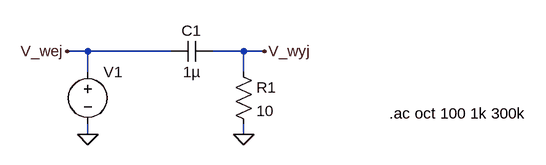
[diagram p0: schematic Draft4.asc]
Draft4.asc, the LTspice schematic file:
Version 4
SHEET 1 880 680
WIRE 16 144 -16 144
WIRE 144 144 16 144
WIRE 256 144 208 144
WIRE 288 144 256 144
WIRE 16 176 16 144
WIRE 256 176 256 144
WIRE 16 272 16 256
WIRE 256 272 256 256
FLAG 16 272 0
FLAG 256 272 0
FLAG -16 144 V_wej
FLAG 288 144 V_wyj
SYMBOL res 240 160 R0
SYMATTR InstName R1
SYMATTR Value 10
SYMATTR SpiceLine tol=1 pwr=0.1
SYMBOL voltage 16 160 R0
WINDOW 3 24 96 Invisible 2
WINDOW 39 0 0 Left 0
SYMATTR InstName V1
SYMATTR Value 5
SYMATTR Value2 AC 1
SYMBOL cap 208 128 R90
WINDOW 0 0 32 VBottom 2
WINDOW 3 32 32 VTop 2
SYMATTR InstName C1
SYMATTR Value 1µ
SYMATTR SpiceLine V=16 Irms=2.59 Rser=0 Lser=0
TEXT 480 240 Left 2 !.ac oct 100 1k 300k

The netlist it stands for:
* Draft4.asc
R1 V_wyj 0 10 tol=1 pwr=0.1
V1 V_wej 0 5 AC 1
C1 V_wyj V_wej 1µ V=16 Irms=2.59 Rser=0 Lser=0
.ac oct 100 1k 300k
.backanno
.end

* Results of the author's LTspice run, read from the files saved beside the schematic
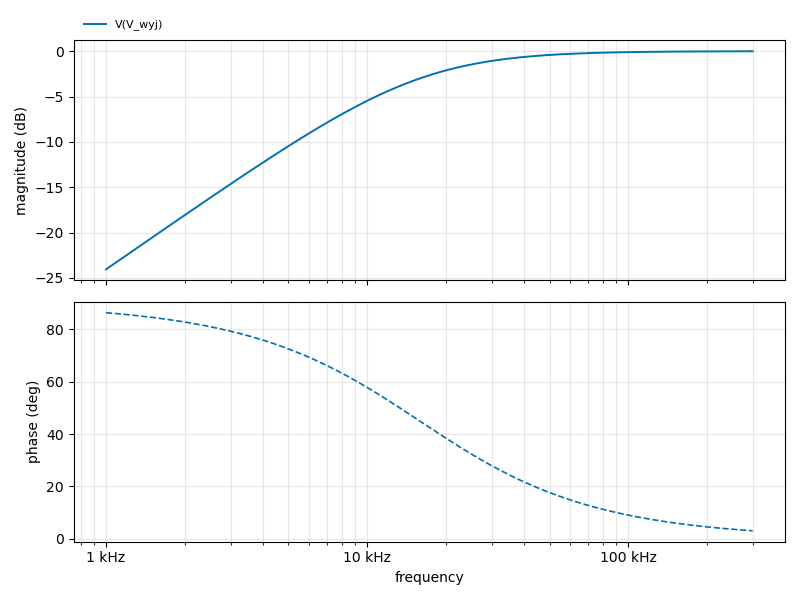
[diagram p1: AC Analysis of Draft4.asc, plotted from the saved traces]
* AC Analysis, 1 run:
*   V(V_wyj): -24.05 dB at 1 kHz, -0.01 dB at 300 kHz, peak -0.01 dB at 300 kHz, 3 dB below the peak at 15.87 kHz